# Altium schematic sheet PicoBOB_DLX.SchDoc: RP2040 CNC
size C; Author: AM; CompanyName: Expatria Technologies; DrawnBy: A.Marles; Engineer: AM; Organization: Expatria Technolgoies; Address1: Schematic; DocumentNumber: 2; SheetNumber: 2; SheetTotal: 4
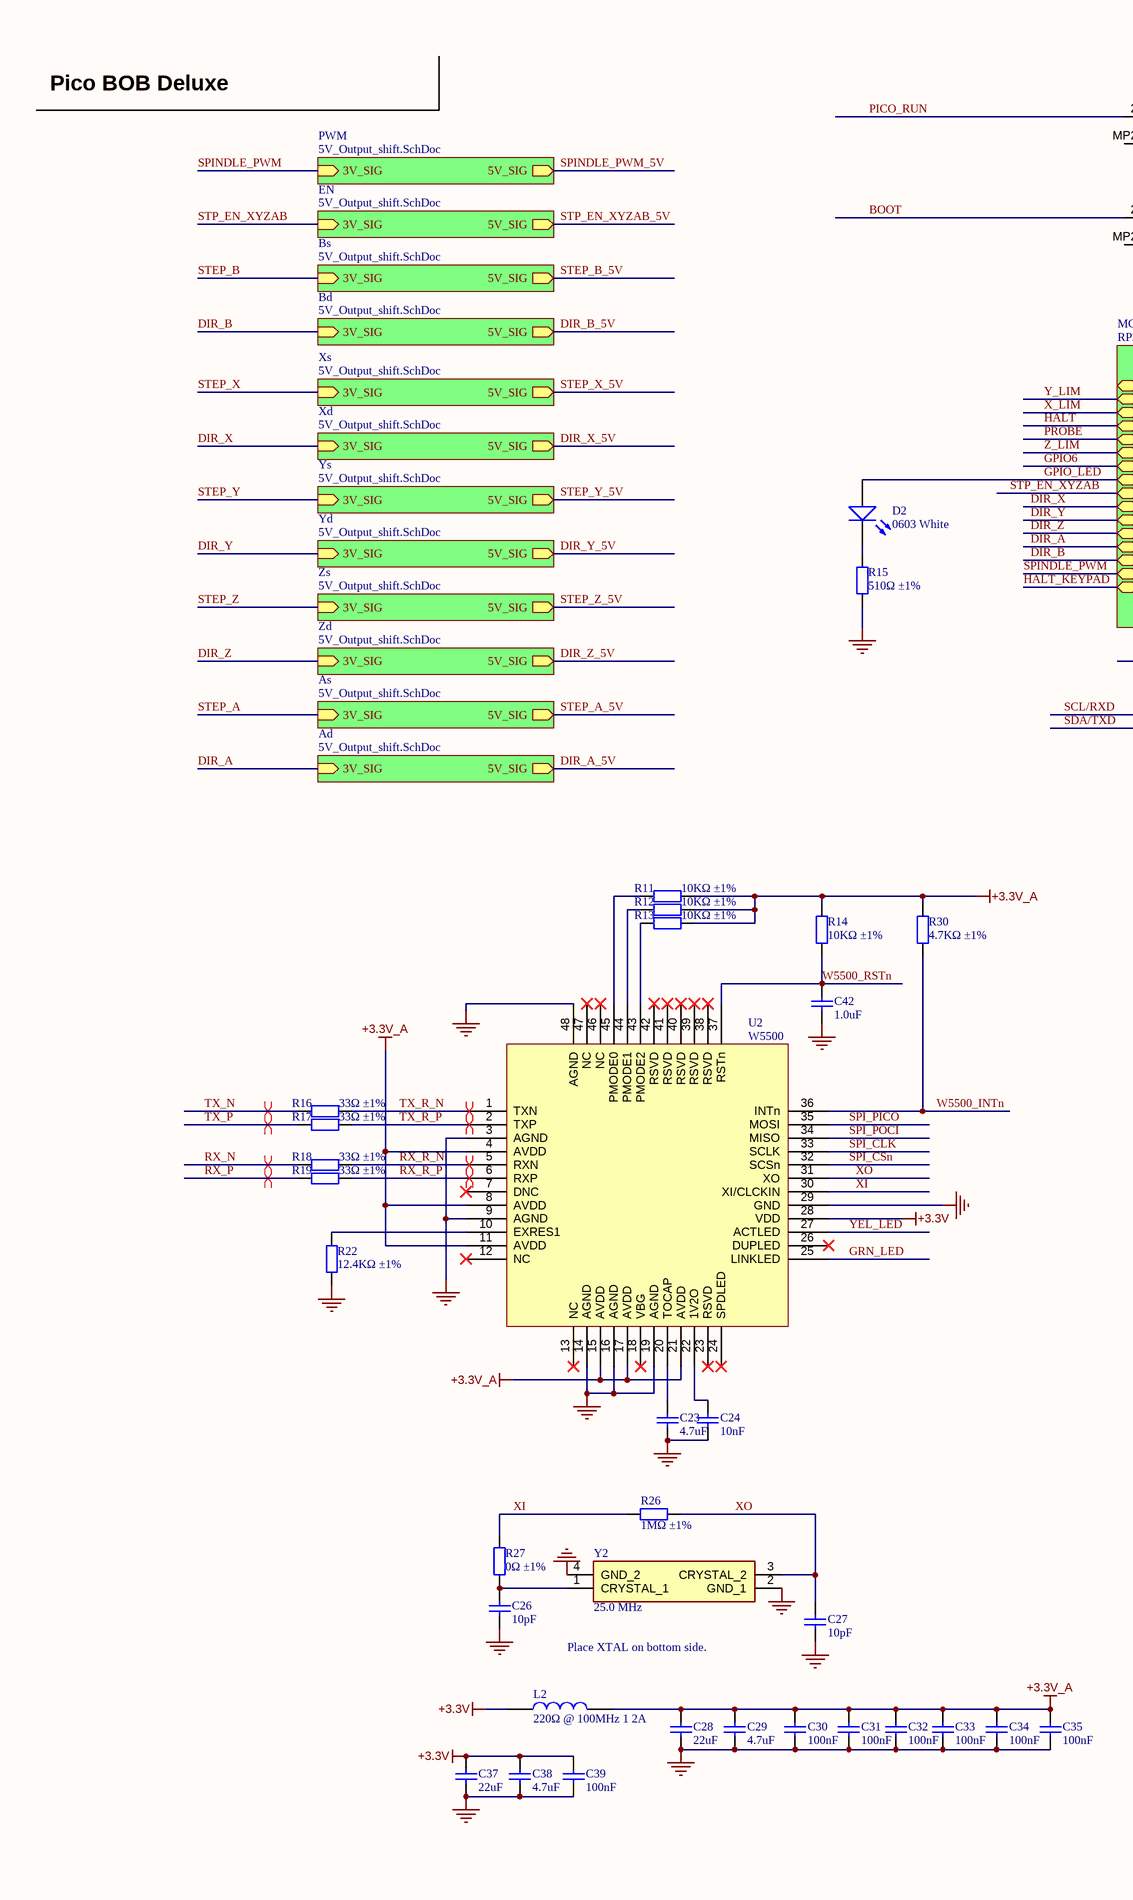
[diagram p0: PicoBOB_DLX.SchDoc, left]
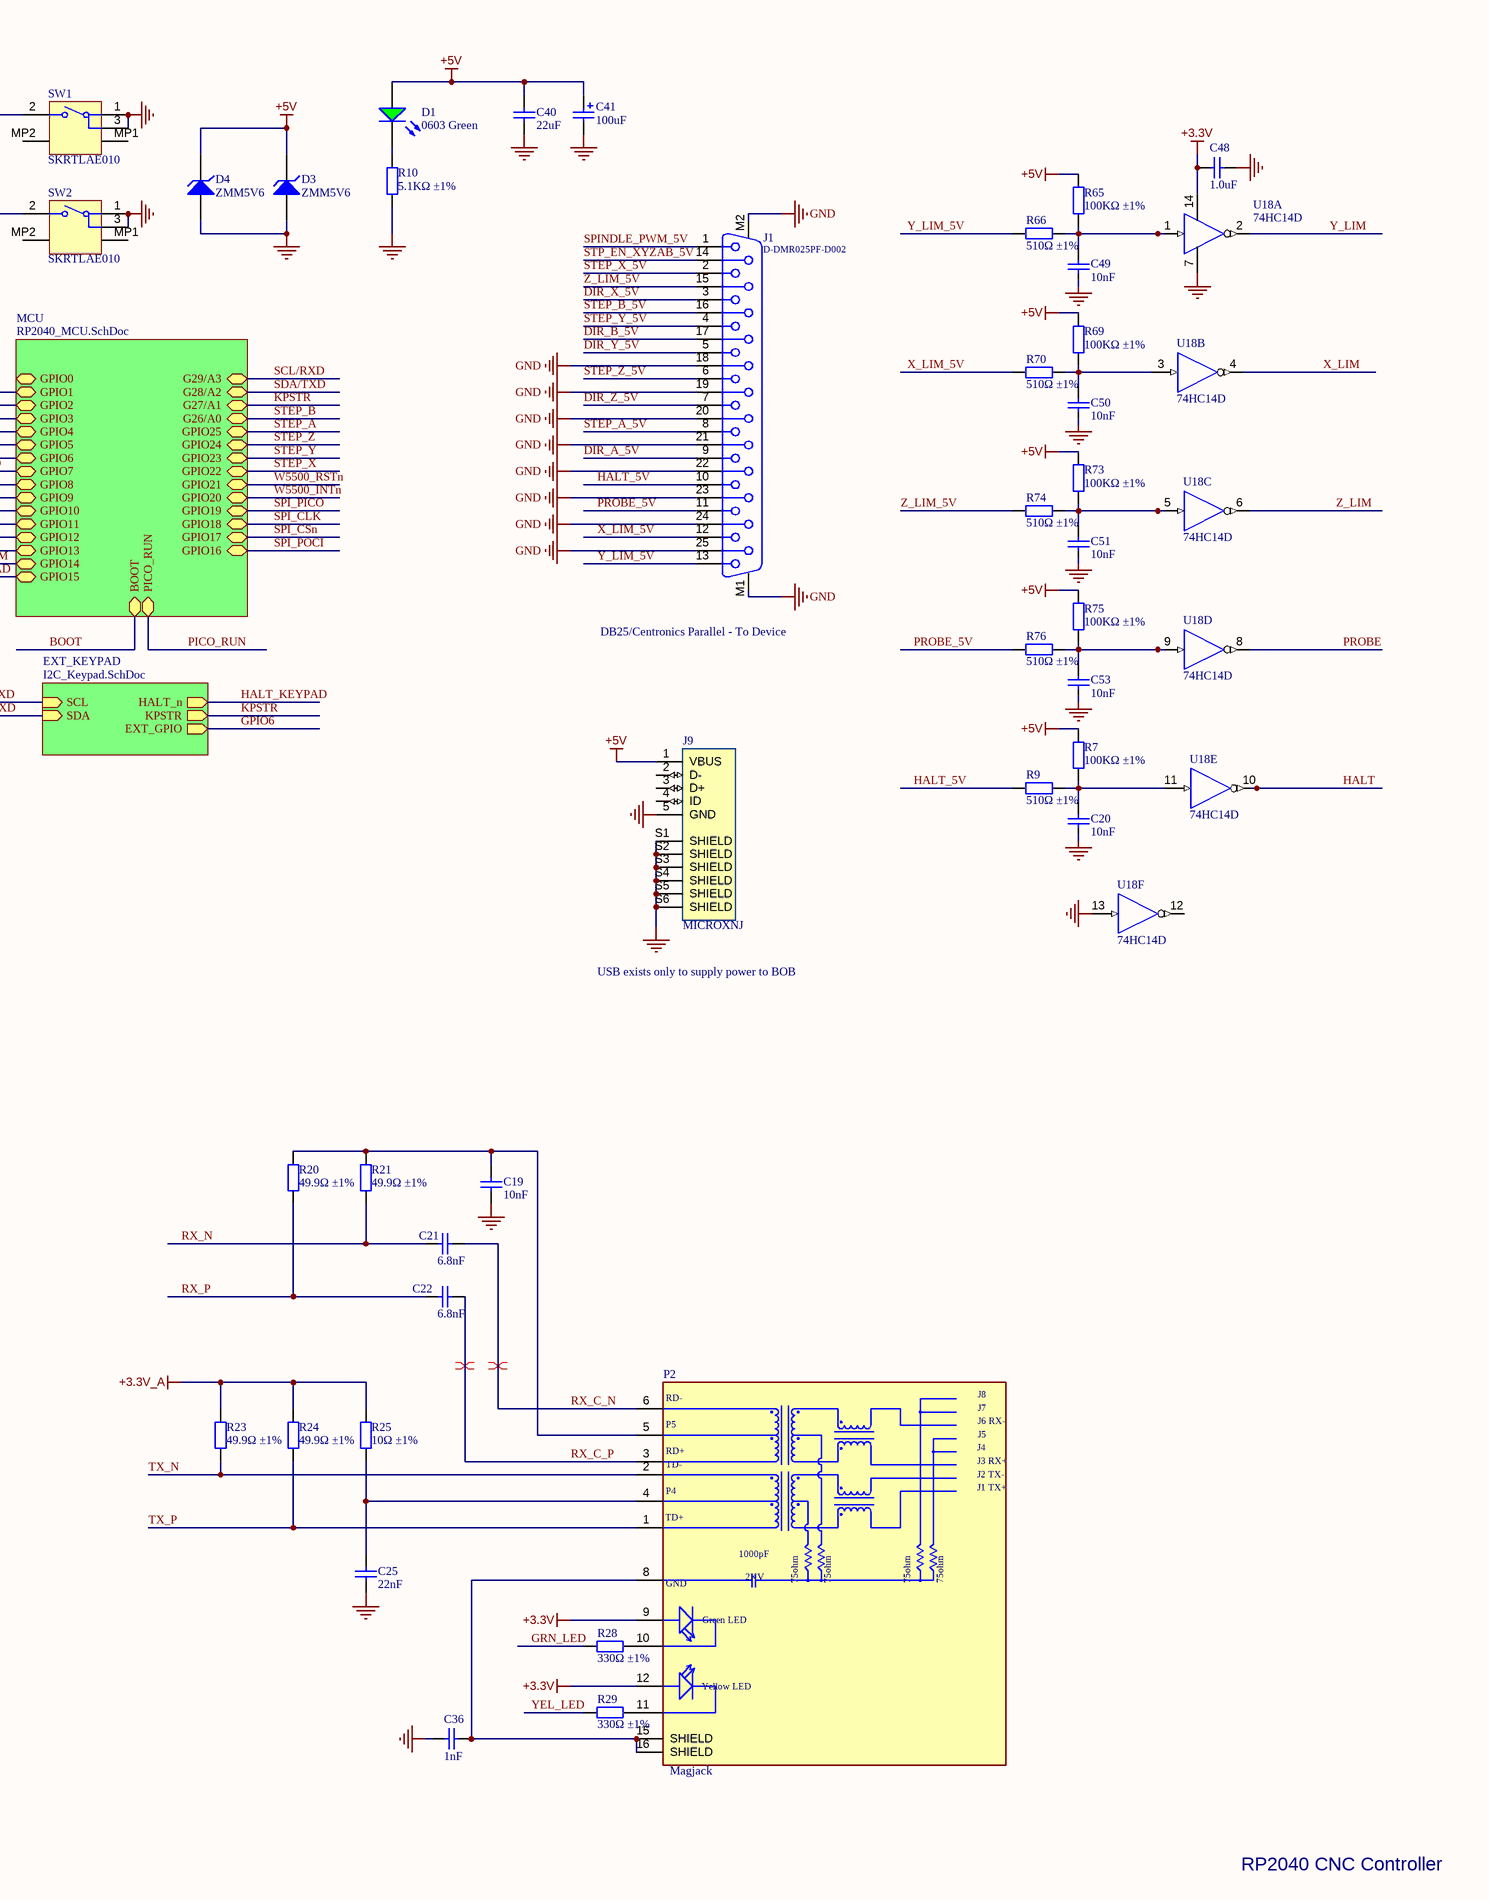
[diagram p1: PicoBOB_DLX.SchDoc, right]

## Parts
C19  10nF  [0402_C]
C20  10nF  [0402_C]
C21  6.8nF  [0402_C]
C22  6.8nF  [0402_C]
C23  4.7uF  [0402_C]
C24  10nF  [0402_C]
C25  22nF  [0402_C]
C26  10pF  [0402_C]
C27  10pF  [0402_C]
C28  22uF  [0805_C]
C29  4.7uF  [0603_C]
C30  100nF  [0402_C]
C31  100nF  [0402_C]
C32  100nF  [0402_C]
C33  100nF  [0402_C]
C34  100nF  [0402_C]
C35  100nF  [0402_C]
C36  1nF  [1206_C]
C37  22uF  [0805_C]
C38  4.7uF  [0603_C]
C39  100nF  [0402_C]
C40  22uF  [0805_C]
C41  100uF  [CASE-B_3528]
C42  1.0uF  [0402_C]
C48  1.0uF  [0402_C]
C49  10nF  [0402_C]
C50  10nF  [0402_C]
C51  10nF  [0402_C]
C53  10nF  [0402_C]
D1  0603 Green  [0603_LED_S1]
D2  0603 White  [0603_LED_S1]
D3  ZMM5V6  [LL-34]
D4  ZMM5V6  [LL-34]
J1  D-DMR025PF-D002  [618025231121]
J9  MICROXNJ  [SHOUHAN_MICROXNJ]
L2  220Ω @ 100MHz 1 2A  [0805_C]
P2  Magjack  [HANRUN_HR911105A]
R7  100KΩ ±1%  [0402_R]
R9  510Ω ±1%  [0402_R]
R10  5.1KΩ ±1%  [0402_R]
R11  10KΩ ±1%  [0402_R]
R12  10KΩ ±1%  [0402_R]
R13  10KΩ ±1%  [0402_R]
R14  10KΩ ±1%  [0402_R]
R15  510Ω ±1%  [0402_R]
R16  33Ω ±1%  [0402_R]
R17  33Ω ±1%  [0402_R]
R18  33Ω ±1%  [0402_R]
R19  33Ω ±1%  [0402_R]
R20  49.9Ω ±1%  [0402_R]
R21  49.9Ω ±1%  [0402_R]
R22  12.4KΩ ±1%  [0603_R]
R23  49.9Ω ±1%  [0402_R]
R24  49.9Ω ±1%  [0402_R]
R25  10Ω ±1%  [0402_R]
R26  1MΩ ±1%  [0402_R]
R27  0Ω ±1%  [0402_R]
R28  330Ω ±1%  [0402_R]
R29  330Ω ±1%  [0402_R]
R30  4.7KΩ ±1%  [0402_R]
R65  100KΩ ±1%  [0402_R]
R66  510Ω ±1%  [0402_R]
R69  100KΩ ±1%  [0402_R]
R70  510Ω ±1%  [0402_R]
R73  100KΩ ±1%  [0402_R]
R74  510Ω ±1%  [0402_R]
R75  100KΩ ±1%  [0402_R]
R76  510Ω ±1%  [0402_R]
SW1  SKRTLAE010  [ALPS-SKRTLAE010_V]
SW2  SKRTLAE010  [ALPS-SKRTLAE010_V]
U2  W5500  [LQFP-48_7x7x05P]
U18  74HC14D  [SOIC-14_150mil]  (parts A,B,C,D,E,F of 6)
Y2  25.0 MHz  [YSX321SL]

## Sub-sheets
Ad = 5V_Output_shift.SchDoc: 3V_SIG (in), 5V_SIG (out)
As = 5V_Output_shift.SchDoc: 3V_SIG (in), 5V_SIG (out)
Bd = 5V_Output_shift.SchDoc: 3V_SIG (in), 5V_SIG (out)
Bs = 5V_Output_shift.SchDoc: 3V_SIG (in), 5V_SIG (out)
EN = 5V_Output_shift.SchDoc: 3V_SIG (in), 5V_SIG (out)
EXT_KEYPAD = I2C_Keypad.SchDoc: HALT_n (out), SCL (in), KPSTR (out), SDA (in), EXT_GPIO (out)
MCU = RP2040_MCU.SchDoc: G28/A2 (bidir), GPIO20 (bidir), GPIO14 (bidir), GPIO25 (bidir), GPIO15 (bidir), GPIO8 (bidir), GPIO1 (bidir), G27/A1 (bidir), GPIO0 (bidir), GPIO13 (bidir), G26/A0 (bidir), GPIO21 (bidir), PICO_RUN (bidir), G29/A3 (bidir), GPIO7 (bidir), GPIO6 (bidir), GPIO12 (bidir), GPIO2 (bidir), GPIO4 (bidir), GPIO17 (bidir), GPIO10 (bidir), GPIO11 (bidir), GPIO23 (bidir), GPIO22 (bidir), GPIO18 (bidir), GPIO5 (bidir), GPIO9 (bidir), GPIO3 (bidir), GPIO24 (bidir), GPIO19 (bidir), GPIO16 (bidir), BOOT (bidir)
PWM = 5V_Output_shift.SchDoc: 3V_SIG (in), 5V_SIG (out)
Xd = 5V_Output_shift.SchDoc: 3V_SIG (in), 5V_SIG (out)
Xs = 5V_Output_shift.SchDoc: 3V_SIG (in), 5V_SIG (out)
Yd = 5V_Output_shift.SchDoc: 3V_SIG (in), 5V_SIG (out)
Ys = 5V_Output_shift.SchDoc: 3V_SIG (in), 5V_SIG (out)
Zd = 5V_Output_shift.SchDoc: 3V_SIG (in), 5V_SIG (out)
Zs = 5V_Output_shift.SchDoc: 3V_SIG (in), 5V_SIG (out)

## Nets
+3.3V: C37.2 C38.2 C39.2 C48.1 L2.1 P2.9(GA) P2.12(YA) U2.28(VDD) U18.14(VDD)
+3.3V_A: C28.2 C29.2 C30.2 C31.2 C32.2 C33.2 C34.2 C35.2 L2.2 R11.1 R12.1 R13.1 R14.2 R23.1 R24.1 R25.1 R30.2 U2.4(AVDD) U2.8(AVDD) U2.11(AVDD) U2.15(AVDD) U2.17(AVDD) U2.21(AVDD)
+5V: C40.2 C41.1 D1.A D3.2(K) D4.2(K) J9.1(VBUS) R7.2 R65.2 R69.2 R73.2 R75.2
GND: C19.1 C20.1 C23.1 C24.1 C25.1 C26.1 C27.1 C28.1 C29.1 C30.1 C31.1 C32.1 C33.1 C34.1 C35.1 C36.1 C37.1 C38.1 C39.1 C40.1 C41.2 C42.1 C48.2 C49.1 C50.1 C51.1 C53.1 D3.1(A) D4.1(A) J1.18 J1.19 J1.20 J1.21 J1.22 J1.23 J1.24 J1.25 J1.M1 J1.M2 J9.5(GND) J9.S1(SHIELD) J9.S2(SHIELD) J9.S3(SHIELD) J9.S4(SHIELD) J9.S5(SHIELD) J9.S6(SHIELD) R10.2 R15.1 R22.1 SW1.1 SW1.3 SW2.1 SW2.3 U2.3(AGND) U2.9(AGND) U2.14(AGND) U2.16(AGND) U2.19(AGND) U2.29(GND) U2.48(AGND) U18.7(GND) U18.13(A) Y2.2(GND_1) Y2.4(GND_2)
BOOT: SW2.2 ; sheet MCU/BOOT
DIR_A: sheet Ad/3V_SIG, sheet MCU/GPIO12
DIR_A_5V: J1.9 ; sheet Ad/5V_SIG
DIR_B: sheet Bd/3V_SIG, sheet MCU/GPIO13
DIR_B_5V: J1.17 ; sheet Bd/5V_SIG
DIR_X: sheet Xd/3V_SIG, sheet MCU/GPIO9
DIR_X_5V: J1.3 ; sheet Xd/5V_SIG
DIR_Y: sheet Yd/3V_SIG, sheet MCU/GPIO10
DIR_Y_5V: J1.5 ; sheet Yd/5V_SIG
DIR_Z: sheet Zd/3V_SIG, sheet MCU/GPIO11
DIR_Z_5V: J1.7 ; sheet Zd/5V_SIG
GPIO6: sheet MCU/GPIO6, sheet EXT_KEYPAD/EXT_GPIO
GPIO_LED: D2.A ; sheet MCU/GPIO7
GRN_LED: R28.1 U2.25(LINKLED)
HALT: U18.10(Y) ; sheet MCU/GPIO3
HALT_5V: J1.10 R9.1
HALT_KEYPAD: sheet MCU/GPIO15, sheet EXT_KEYPAD/HALT_n
KPSTR: sheet MCU/G27/A1, sheet EXT_KEYPAD/KPSTR
PICO_RUN: SW1.2 ; sheet MCU/PICO_RUN
PROBE: U18.8(Y) ; sheet MCU/GPIO4
PROBE_5V: J1.11 R76.1
RX_C_N: C21.1 P2.6(RD-)
RX_C_P: C22.1 P2.3(RD+)
RX_N: C21.2 R18.1 R21.2
RX_P: C22.2 R19.1 R20.2
RX_R_N: R18.2 U2.5(RXN)
RX_R_P: R19.2 U2.6(RXP)
SCL/RXD: sheet MCU/G29/A3, sheet EXT_KEYPAD/SCL
SDA/TXD: sheet MCU/G28/A2, sheet EXT_KEYPAD/SDA
SPI_CLK: U2.33(SCLK) ; sheet MCU/GPIO18
SPI_CSn: U2.32(SCSn) ; sheet MCU/GPIO17
SPI_PICO: U2.35(MOSI) ; sheet MCU/GPIO19
SPI_POCI: U2.34(MISO) ; sheet MCU/GPIO16
SPINDLE_PWM: sheet PWM/3V_SIG, sheet MCU/GPIO14
SPINDLE_PWM_5V: J1.1 ; sheet PWM/5V_SIG
STEP_A: sheet As/3V_SIG, sheet MCU/GPIO25
STEP_A_5V: J1.8 ; sheet As/5V_SIG
STEP_B: sheet Bs/3V_SIG, sheet MCU/G26/A0
STEP_B_5V: J1.16 ; sheet Bs/5V_SIG
STEP_X: sheet Xs/3V_SIG, sheet MCU/GPIO22
STEP_X_5V: J1.2 ; sheet Xs/5V_SIG
STEP_Y: sheet Ys/3V_SIG, sheet MCU/GPIO23
STEP_Y_5V: J1.4 ; sheet Ys/5V_SIG
STEP_Z: sheet Zs/3V_SIG, sheet MCU/GPIO24
STEP_Z_5V: J1.6 ; sheet Zs/5V_SIG
STP_EN_XYZAB: sheet EN/3V_SIG, sheet MCU/GPIO8
STP_EN_XYZAB_5V: J1.14 ; sheet EN/5V_SIG
TX_N: P2.2(TD-) R16.1 R23.2
TX_P: P2.1(TD+) R17.1 R24.2
TX_R_N: R16.2 U2.1(TXN)
TX_R_P: R17.2 U2.2(TXP)
W5500_INTn: R30.1 U2.36(INTn) ; sheet MCU/GPIO20
W5500_RSTn: C42.2 R14.1 U2.37(RSTn) ; sheet MCU/GPIO21
X_LIM: U18.4(Y) ; sheet MCU/GPIO2
X_LIM_5V: J1.12 R70.1
XI: R26.1 R27.1 U2.30(XI/CLCKIN)
XO: C27.2 R26.2 U2.31(XO) Y2.3(CRYSTAL_2)
Y_LIM: U18.2(Y) ; sheet MCU/GPIO1
Y_LIM_5V: J1.13 R66.1
YEL_LED: R29.1 U2.27(ACTLED)
Z_LIM: U18.6(Y) ; sheet MCU/GPIO5
Z_LIM_5V: J1.15 R74.1
NetC19_2: C19.2 P2.5(P5) R20.1 R21.1
NetC20_2: C20.2 R7.1 R9.2 U18.11(A)
NetC23_2: C23.2 U2.20(TOCAP)
NetC24_2: C24.2 U2.22(1V2O)
NetC25_2: C25.2 P2.4(P4) R25.2
NetC26_2: C26.2 R27.2 Y2.1(CRYSTAL_1)
NetC36_2: C36.2 P2.8(GND) P2.15(SHIELD) P2.16(SHIELD)
NetC49_2: C49.2 R65.1 R66.2 U18.1(A)
NetC50_2: C50.2 R69.1 R70.2 U18.3(A)
NetC51_2: C51.2 R73.1 R74.2 U18.5(A)
NetC53_2: C53.2 R75.1 R76.2 U18.9(A)
NetD1_K: D1.K R10.1
NetD2_K: D2.K R15.2
NetP2_10: P2.10(GC) R28.2
NetP2_11: P2.11(YC) R29.2
NetR11_2: R11.2 U2.45(PMODE0)
NetR12_2: R12.2 U2.44(PMODE1)
NetR13_2: R13.2 U2.43(PMODE2)
NetR22_2: R22.2 U2.10(EXRES1)

Not connected (* = marked no-connect by the designer): J9 2(D-) 3(D+) 4(ID); SW1 MP1 MP2; SW2 MP1 MP2; U2 7(DNC)* 12(NC)* 13(NC)* 18(VBG)* 23(RSVD)* 24(SPDLED)* 26(DUPLED)* 38(RSVD)* 39(RSVD)* 40(RSVD)* 41(RSVD)* 42(RSVD)* 46(NC)* 47(NC)*; U18 12(Y)

## Layout directives
differential pair: RX_C_N, RX_C_P, RX_N, RX_P, RX_R_N, RX_R_P, TX_N, TX_P, TX_R_N, TX_R_P

## Notes on the sheet
- Pico BOB Deluxe
- DB25/Centronics Parallel - To Device
- USB exists only to supply power to BOB
- Place XTAL on bottom side.
- RP2040 CNC Controller
- Expatria Technologies
- SHEET
- PROJECT
- REV
- 1136 Glade Court
- Port Coquitlam, BC V3B 1R5
- EMAIL: INFO@EXPATRIA.CA
- SIZE
- ENGR
- C
- MODIFIED
- DOCUMENT
- /
- Copyright Expatria Technologies 2023. This document describes Open Hardware and is licensed under the CERN-OHL-S v2. No warranty is implied or expressed.
- (in symbol HR911105A) J8; J7; J6 RX-; J5; J4; J3 RX+; J2 TX-; J1 TX+; 1000pF; 2KV; 75ohm; Green LED; Yellow LED

## Library data of the parts
C19 C20 C24 C49-C51 C53 = 0402 10nF (103) 10% 50V: Chip capacitors; Manufacturer: Samsung Electro-Mechanics; PartNumber: CL05B103KB5NNNC; Tolerance: 10%; Voltage: 50V; ComponentLink1Description: Supplier link; ComponentLink1URL: http://www.szlcsc.com/product/details_15869.html; Package: 0402; Supplier: LC; SuppliersPartNumber: C15195; Capacitance: 10nF
C21 C22 = 0402 6.8nF (682) 10% 50V: Chip capacitors; Manufacturer: Guangdong Fenghua Advanced Tech; PartNumber: 0402B682K500NT; Tolerance: 10%; Voltage: 50V; ComponentLink1Description: Supplier link; ComponentLink1URL: http://www.szlcsc.com/product/details_1894.html; Package: 0402; Supplier: LC; SuppliersPartNumber: C1542; Capacitance: 6.8nF
C23 = 0402 4.7uF (475) 20% 10V: Chip capacitor; Manufacturer: Samsung Electro-Mechanics; PartNumber: CL05A475MP5NRNC; Tolerance: 20%; Voltage: 10V; ComponentLink1Description: Supplier link; ComponentLink1URL: http://www.szlcsc.com/product/details_24469.html; Package: 0402; Supplier: LC; SuppliersPartNumber: C23733; Capacitance: 4.7uF
C25 = 0402 22nF (223) 10% 50V: Chip capacitors; Manufacturer: Guangdong Fenghua Advanced Tech; PartNumber: 0402B223K500NT; Tolerance: 10%; Voltage: 50V; ComponentLink1Description: Supplier link; ComponentLink1URL: http://www.szlcsc.com/product/details_1884.html; Package: 0402; Supplier: LC; SuppliersPartNumber: C1532; Capacitance: 22nF
C26 C27 = 0402 10pF (100) 5% 50V: Chip capacitors; Manufacturer: Samsung Electro-Mechanics; PartNumber: CL05C100JB5NNNC; Tolerance: 5%; Voltage: 50V; ComponentLink1Description: Supplier link; ComponentLink1URL: http://www.szlcsc.com/product/details_33914.html; Package: 0402; Supplier: LC; SuppliersPartNumber: C32949; Capacitance: 10pF
C28 C37 C40 = 0805 22uF (226) 20% 25V: Chip capacitors; Manufacturer: Samsung Electro-Mechanics; PartNumber: CL21A226MAQNNNE; Tolerance: 20%; Voltage: 25V; ComponentLink1Description: Supplier link; ComponentLink1URL: http://www.szlcsc.com/product/details_46786.html; Package: 0805; Supplier: LC; SuppliersPartNumber: C2922481; Capacitance: 22uF
C29 C38 = 0603 4.7uF (475) 10% 16V: Chip capacitors; Manufacturer: Samsung Electro-Mechanics; PartNumber: CL10A475KO8NNNC; Tolerance: 10%; Voltage: 16V; ComponentLink1Description: Supplier link; ComponentLink1URL: http://www.szlcsc.com/product/details_20375.html; Package: 0603; Supplier: LC; SuppliersPartNumber: C19666; Capacitance: 4.7uF
C30-C35 C39 = 0402 100nF (104) 10% 16V: Chip capacitors; Manufacturer: Samsung Electro-Mechanics; PartNumber: CL05B104KO5NNNC; Tolerance: 10%; Voltage: 16V; ComponentLink1Description: Supplier link; ComponentLink1URL: http://www.szlcsc.com/product/details_1877.html; Package: 0402; Supplier: LC; SuppliersPartNumber: C1525; Capacitance: 100nF
C36 = 1206 1nF (102) 10% 500V: Chip capacitors; Manufacturer: Samsung Electro-Mechanics; PartNumber: CL31B102KGFNNNE; Tolerance: 10%; Voltage: 500V; ComponentLink1Description: Supplier link; ComponentLink1URL: http://www.szlcsc.com/product/details_36187.html; Package: 1206; Supplier: LC; SuppliersPartNumber: C35216; Capacitance: 1nF
C41 = 3528 100uF (107) 10% 6.3V: Tantalum capacitor; Manufacturer: AVX; PartNumber: TAJB107K006RNJ; Tolerance: 10%; Voltage: 6.3V; ComponentLink1Description: Supplier link; ComponentLink1URL: http://www.szlcsc.com/product/details_16815.html; Package: 3528; Supplier: LC; SuppliersPartNumber: C16133; Capacitance: 100uF
C42 C48 = 0402 1.0uF (105) 10% 25V: Chip capacitor; Manufacturer: Samsung Electro-Mechanics; PartNumber: CL05A105KA5NQNC; Capacitance: 1uF; Tolerance: 10%; Voltage: 25V; ComponentLink1Description: Supplier link; ComponentLink1URL: http://www.szlcsc.com/product/details_53938.html; Package: 0402; Supplier: LC; SuppliersPartNumber: C52923
D1 = 0603 LED Green: LED; ComponentLink1Description: 供应商链接; ComponentLink1URL: http://www.szlcsc.com/product/details_73152.html; Package: 0603; Supplier: LC; SuppliersPartNumber: C72043; Color: Green
D2 = 0603 LED White: LED; Package: 0603; Supplier: LC; SuppliersPartNumber: C2290; Color: White; ComponentLink1Description: 供应商链接; ComponentLink1URL: http://www.szlcsc.com/product/details_2663.html
D3 D4 = LL-34 ZMM5V6: 500mW - 0.1uA @ 1V 5.6V LL-34 Zener Diodes ROHS; ComponentLink1Description: 供应商链接; ComponentLink1URL: http://www.szlcsc.com/product/details_8541.html; Package: LL-34; Supplier: LC; SuppliersPartNumber: C8062
J1 = CMP-1502-00202-1: Through Hole,P=2.77mm D-Sub Connectors ROHS; SuppliersPartNumber: C190083; PartNumber: D-DMR025PF-D002
J9 = MICROXNJ: Micro USB; MF: Shouhan; Package: Package; SuppliersPartNumber: C404969; Check_prices: https://www.snapeda.com/parts/MICROXNJ/Shouhan/view-part/5703693/?ref=eda; Price: None; SnapEDA_Link: https://www.snapeda.com/parts/MICROXNJ/Shouhan/view-part/5703693/?ref=snap; Availability: Unavailable; MP: MICROXNJ; Value: *
L2 = 0402 220R@100Mhz 0.1A: 220Ω @ 100MHz 1 2A 150mΩ 0805 Ferrite Beads ROHS; Notepad: *; Package: 0805; Supplier: LC; SuppliersPartNumber: C139188
P2 = HR911105A: HR911105A Ethernet Interface Arduino Platform Evaluation Expansion Board; MF: DFRobot; SuppliersPartNumber: C163507; Package: None; Availability: Unavailable; MP: HR911105A; Value: *; Price: None
R7 R65 R69 R73 R75 = 0402 100K (1003) 1%: Chip resistor; Manufacturer: Uniroyal Elec; PartNumber: 0402WGF1003TCE; Power: 1/16W; ComponentLink1Description: Supplier link; ComponentLink1URL: http://www.szlcsc.com/product/details_26484.html; Package: 0402; Supplier: LC; SuppliersPartNumber: C25741; Resistance: 100KΩ; Tolerance: 1%
R9 R15 R66 R70 R74 R76 = 0402 510R (5100) 1%: Chip resistor; Manufacturer: Uniroyal Elec; PartNumber: 0402WGF5100TCE; Power: 1/16W; ComponentLink1Description: Supplier link; ComponentLink1URL: http://www.szlcsc.com/product/details_25866.html; Package: 0402; Supplier: LC; SuppliersPartNumber: C25123; Resistance: 510Ω; Tolerance: 1%
R10 = 0402 5.1K (5101) 1%: Chip resistor; Manufacturer: Uniroyal Elec; PartNumber: 0402WGF5101TCE; Power: 1/16W; Resistance: 51.1KΩ; ComponentLink1Description: Supplier link; ComponentLink1URL: http://www.szlcsc.com/product/details_26648.html; Package: 0402; Supplier: LC; SuppliersPartNumber: C25905; Tolerance: 1%
R11-R14 = 0402 10K (1002) 1%: Chip resistor; Manufacturer: Uniroyal Elec; PartNumber: 0402WGF1002TCE; Power: 1/16W; ComponentLink1Description: Supplier link; ComponentLink1URL: http://www.szlcsc.com/product/details_26487.html; Package: 0402; Supplier: LC; SuppliersPartNumber: C25744; Resistance: 10KΩ; Tolerance: 1%
R16-R19 = 0402 33R (33R0) 1%: Chip resistor; Manufacturer: Uniroyal Elec; PartNumber: 0402WGF330JTCE; Power: 1/16W; ComponentLink1Description: Supplier link; ComponentLink1URL: http://www.szlcsc.com/product/details_25848.html; Package: 0402; Supplier: LC; SuppliersPartNumber: C25105; Resistance: 33Ω; Tolerance: 1%
R20 R21 R23 R24 = 0402 49.9R (49R9) 1%: Chip resistor; Manufacturer: Uniroyal Elec; PartNumber: 0402WGF499JTCE; Power: 1/16W; ComponentLink1Description: Supplier link; ComponentLink1URL: http://www.szlcsc.com/product/details_25863.html; Package: 0402; Supplier: LC; SuppliersPartNumber: C25120; Resistance: 49.9Ω; Tolerance: 1%
R22 = 0603 10K (1002) 1%: Chip resistor; Manufacturer: Uniroyal Elec; PartNumber: 0603WAF1242T5E; Power: 1/10W; Resistance: 12.4K; ComponentLink1Description: Supplier link; ComponentLink1URL: http://www.szlcsc.com/product/details_26547.html; Package: 0603; Supplier: LC; SuppliersPartNumber: C22865; Tolerance: 1%
R25 = 0402 10R (10R0) 1%: Chip resistor; Manufacturer: Uniroyal Elec; PartNumber: 0402WGF100JTCE; Power: 1/16W; ComponentLink1Description: Supplier link; ComponentLink1URL: http://www.szlcsc.com/product/details_25820.html; Package: 0402; Supplier: LC; SuppliersPartNumber: C25077; Resistance: 10Ω; Tolerance: 1%
R26 = 0402 1M (1004) 1%: Chip resistor; Manufacturer: Uniroyal Elec; PartNumber: 0402WGF1004TCE; Power: 1/16W; ComponentLink1Description: Supplier link; ComponentLink1URL: http://www.szlcsc.com/product/details_26826.html; Package: 0402; Supplier: LC; SuppliersPartNumber: C26083; Resistance: 1MΩ; Tolerance: 1%
R27 = 0402 0R (0R0) 1%: Chip resistor; Manufacturer: Uniroyal Elec; PartNumber: 0402WGF0000TCE; Power: 1/16W; ComponentLink1Description: Supplier link; ComponentLink1URL: http://www.szlcsc.com/product/details_17853.html; Package: 0402; Supplier: LC; SuppliersPartNumber: C17168; Resistance: 0Ω; Tolerance: 1%
R28 R29 = 0402 330R (3300) 1%: Chip resistor; Manufacturer: Uniroyal Elec; PartNumber: 0402WGF3300TCE; Power: 1/16W; ComponentLink1Description: Supplier link; ComponentLink1URL: http://www.szlcsc.com/product/details_25847.html; Package: 0402; Supplier: LC; SuppliersPartNumber: C25104; Resistance: 330Ω; Tolerance: 1%
R30 = 0402 4.7K (4701) 1%: Chip resistor; Manufacturer: Uniroyal Elec; PartNumber: 0402WGF4701TCE; Power: 1/16W; ComponentLink1Description: Supplier link; ComponentLink1URL: http://www.szlcsc.com/product/details_26643.html; Package: 0402; Supplier: LC; SuppliersPartNumber: C25900; Resistance: 4.7KΩ; Tolerance: 1%
SW1 SW2 = CMP-2000-07073-2: Side Push Type, 250 V, -40 to 90 degC, 3-Pin SMD, RoHS, Tape and Reel; Manufacturer: ALPS; Operating Force: 1.6N; Folder: Unified Components\Components\New Releases\New\; Maximum Current Rating: 0.05@12VDCA; RevisionId: 1; Pole Throw Configuration: SPST; Switch Configuration: N.O.; AccessRights: 2147483647; Maximum DC Voltage Rating: 12V; ContentType: Unified Component; Rad Hard: No; Mounting: SurfaceMount; Datasheet URL: http://www.alps.com/prod/info/E/PDF/Tact/SurfaceMount/SKRT/SKRT.PDF; Manufacturer URL: http://www.alps.com/e/; ReleaseDate: 22/09/2017 06:13:25 AM; ItemHRID: CMP-2000-07073; ContentTypeGUID: CB3C11C4-E317-11DF-B822-12313F0024A2; LifeCycle: Released; ItemGUID: EAC55BEC-37DC-4BDB-8BA7-D75E6D5C3D75; Packaging: Tape&Reel; Package Reference: SKRTLAE010; FolderGUID: B7F4506A-9127-42E7-A087-46FE7B18D116; Datasheet Version: 06/2015; Mounting Technology: SurfaceMount; LifeCycleStateGUID: 61E382EE-6656-4F12-9E24-BE9327104A25; Package Description: 3-Pin Surface Mount Device, Body 4.5 x 3.55 mm, Pitch 1.225 mm; SuppliersPartNumber: C110293; Manufacturer 1: ALPS
U2 = W5500_[C32843]: Ethernet Controllers 2.97V ~ 3.63V 10/100 Base-T/TX PHY SPI LQFP-48_7x7x05P Ethernet ICs ROHS; ComponentLink1Description: 供应商链接; ComponentLink1URL: http://www.szlcsc.com/product/details_33808.html; Package: LQFP-48_7x7x05P; Supplier: LC; SuppliersPartNumber: C32843
U18 = 74HC14D_[C5605]: 74系列逻辑芯片; ComponentLink1Description: 供应商链接; ComponentLink1URL: http://www.szlcsc.com/product/details_6056.html; Package: SOIC-14_150mil; Supplier: LC; SuppliersPartNumber: C5605
Y2 = YSX321SL: Crystal or Oscillator; Manufacturer_Name: Yangxing Tech; Manufacturer_Part_Number: X322525MSB4SI; Height: 0.8mm; SuppliersPartNumber: C13740